# Altium schematic sheet PA_Channel.SchDoc: RF Channel
size 420 x 297 mm; Author: G.K.; CompanyName: WUT; DrawnBy: G.K.; Organization: WUT ISE; Address1: Warsaw Univeristy of Technology; Address2: Nowowiejska 15/19; Revision: -; SheetNumber: -; SheetTotal: -; EDA_Number: ARTIQ; Projet: 8 Channel RF Power Amplifier; ModifiedBy: -; CreateDate: XX/XX/XXXX; CheckedDate: -; Title2: Power supply & protection; DivGrp: ISE; Designer: G.K.; ModifiedDate: -; ProjectName: 8 Channel RF Power Amplifier
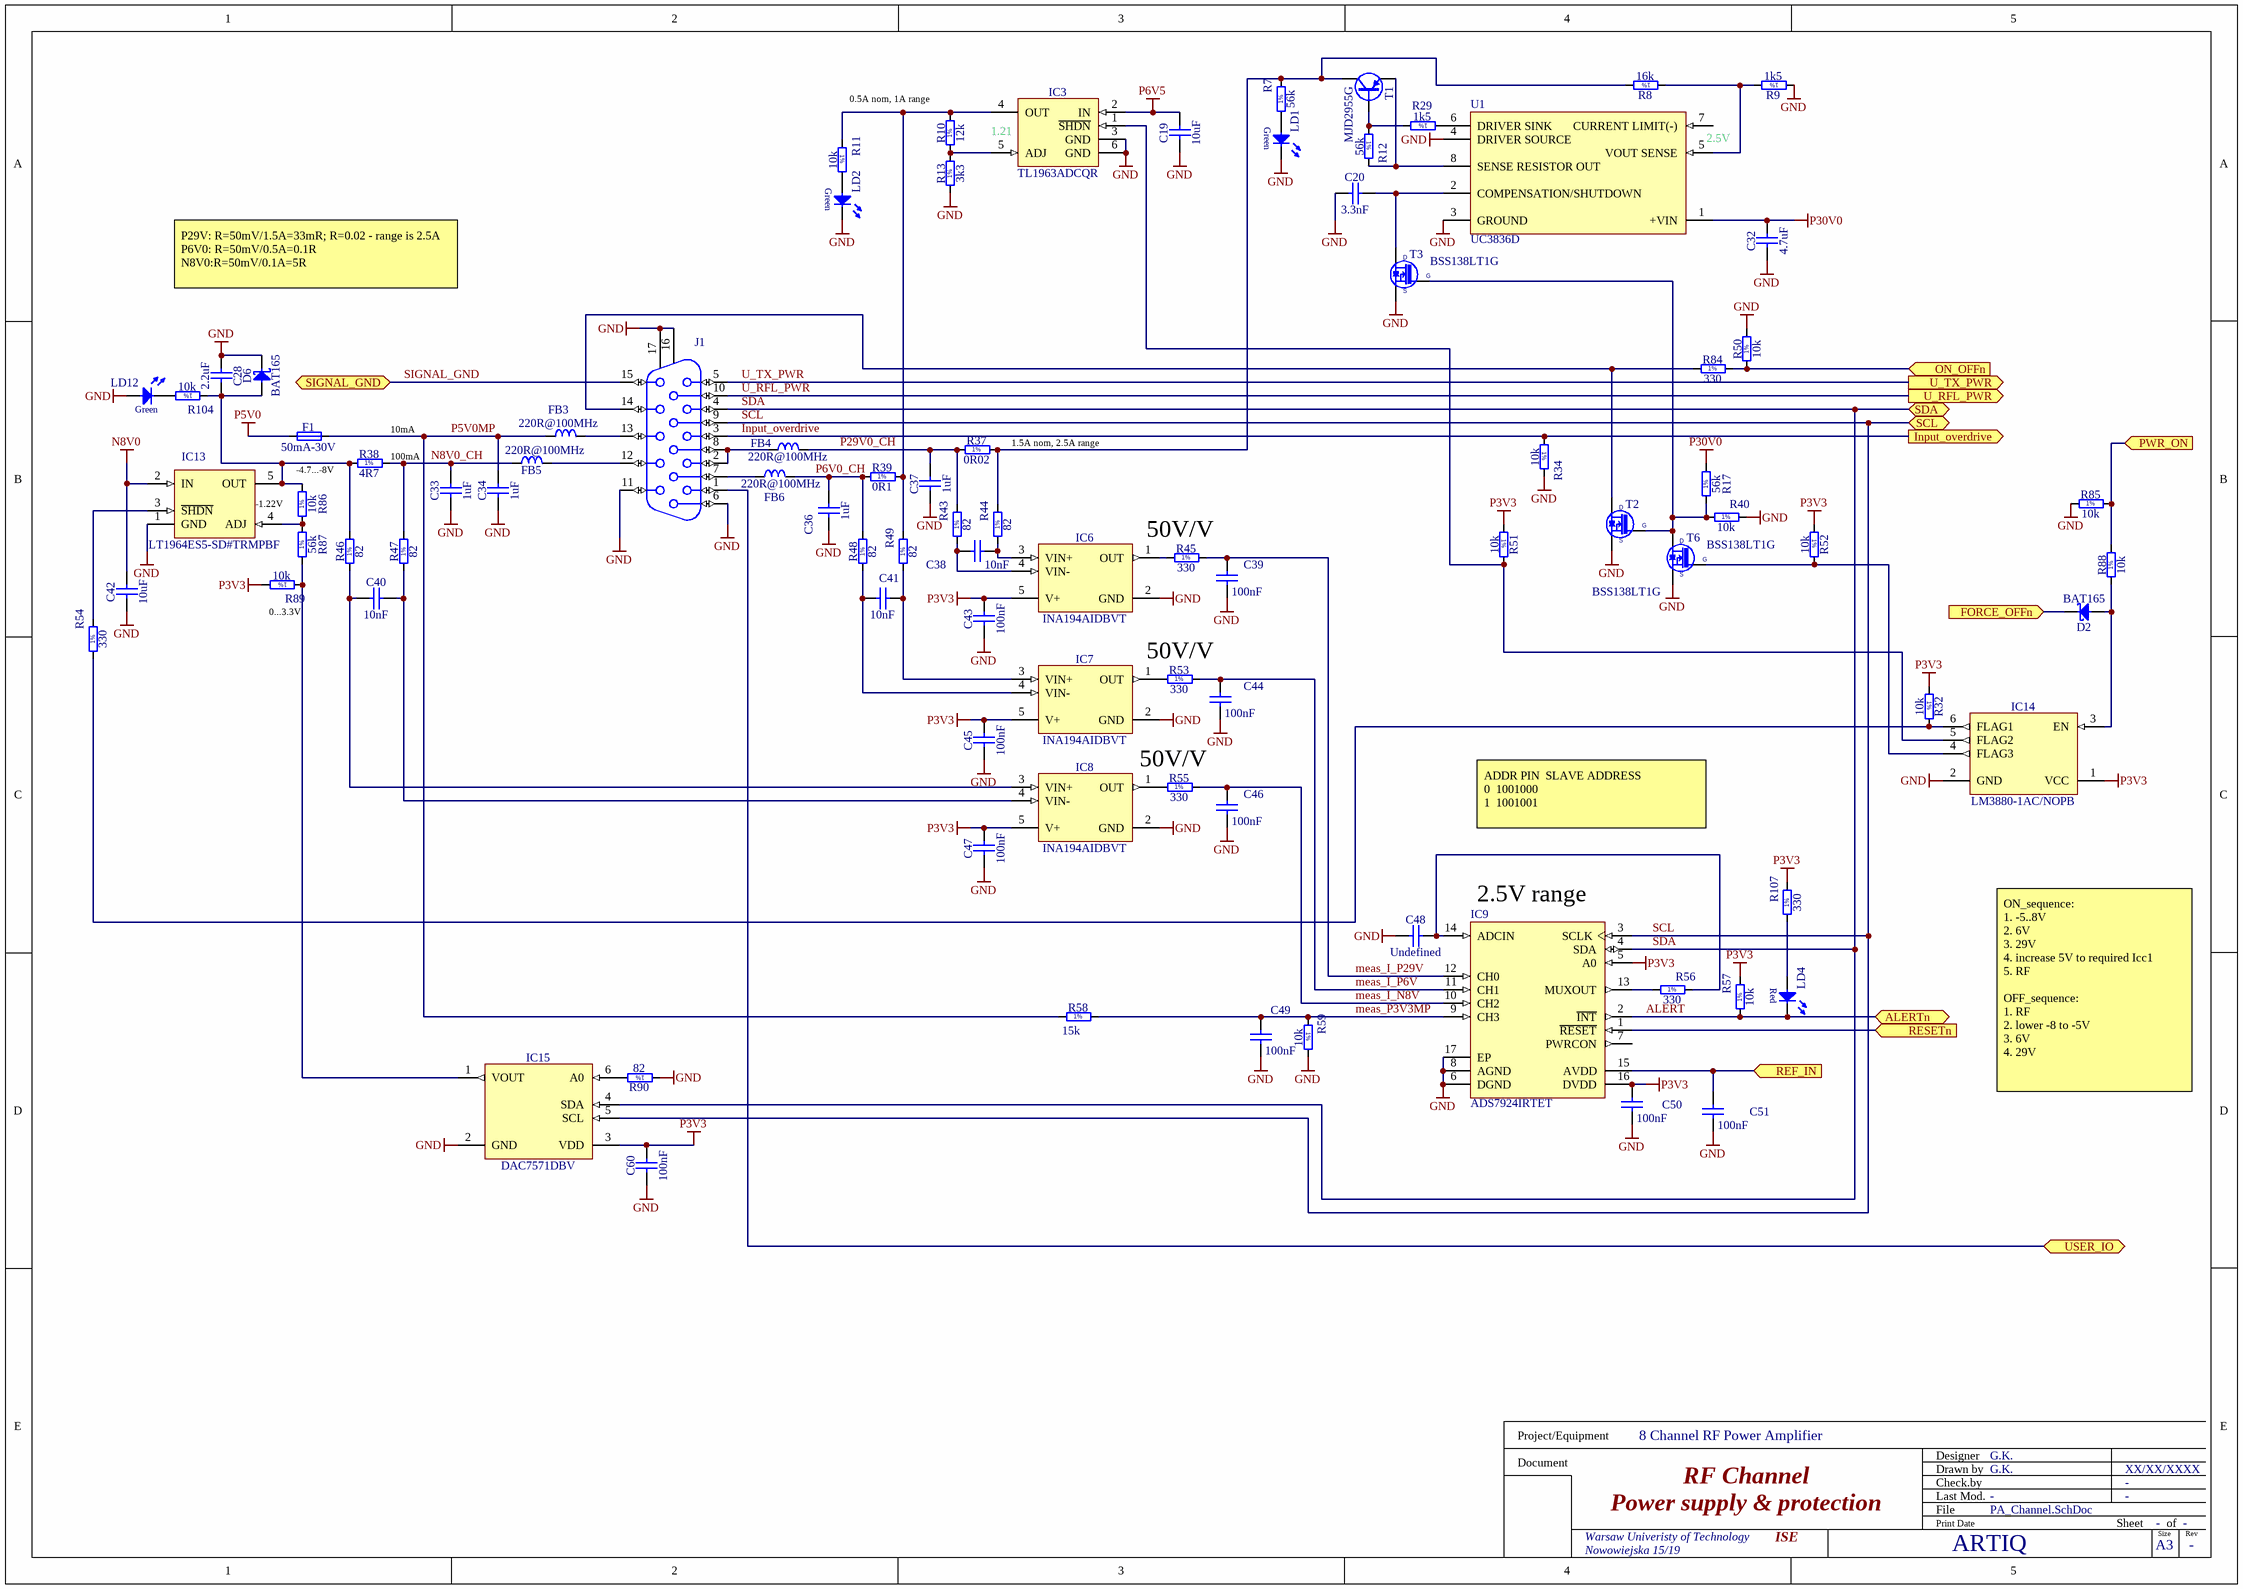
[diagram p0: PA_Channel.SchDoc]

## Parts
C19  10uF  [CAPC3216X140N]
C20  3.3nF  [CAPC1005X55N]
C28  2.2uF  [CAPC1608X87N]
C32  4.7uF  [CAPC3216X180N]
C33  1uF  [CAPC2012X110N]
C34  1uF  [CAPC2012X110N]
C36  1uF  [CAPC2012X110N]
C37  1uF  [CAPC2012X110N]
C38  10nF  [CAPC1608X87N]
C39  100nF  [CAPC1005X55N]
C40  10nF  [CAPC1608X87N]
C41  10nF  [CAPC1608X87N]
C42  10uF  [CAPC3216X140N]
C43  100nF  [CAPC1005X55N]
C44  100nF  [CAPC1005X55N]
C45  100nF  [CAPC1005X55N]
C46  100nF  [CAPC1005X55N]
C47  100nF  [CAPC1005X55N]
C48  Undefined  [CAPC1005X55N]
C49  100nF  [CAPC1005X55N]
C50  100nF  [CAPC1005X55N]
C51  100nF  [CAPC1005X55N]
C60  100nF  [CAPC1005X55N]
D2  BAT165  [SOD2512X110N]
D6  BAT165  [SOD2512X110N]
F1  50mA-30V  [FUSRC3226X85N]
FB3  220R@100MHz  [INDC2012X105N]
FB4  220R@100MHz  [INDC2012X105N]
FB5  220R@100MHz  [INDC2012X105N]
FB6  220R@100MHz  [INDC2012X105N]
IC3  TL1963ADCQR  [SOT127P700X180-6N]
IC6  INA194AIDBVT  [SOT95P280X145-5N]
IC7  INA194AIDBVT  [SOT95P280X145-5N]
IC8  INA194AIDBVT  [SOT95P280X145-5N]
IC9  ADS7924IRTET  [TI-RTE16-1700X1700TP_V]
IC13  LT1964ES5-SD#TRMPBF  [SOT95P280X100-5N]
IC14  LM3880-1AC/NOPB  [SOT95P280X145-6N]
IC15  DAC7571DBV  [SOT95P280X145-6N]
J1  HD-Sub  [TYCO_1932144-1]  (value not drawn)
LD1  Green  [LED_KINGBRIGHT_KPH-1608CGCK]  (value not drawn)
LD2  Green  [LED_KINGBRIGHT_KPH-1608CGCK]  (value not drawn)
LD4  Hyper Red  [LED_KINGBRIGHT_KPH-1608SURCK]  (value not drawn)
LD12  Green  [LED_KINGBRIGHT_KPH-1608CGCK]  (value not drawn)
R7  56k  [RESC1608X55N]
R8  16k  [RESC1608X55N]
R9  1k5  [RESC1608X55N]
R10  12k  [RESC1005X40N]
R11  10k  [RESC1005X40N]
R12  56k  [RESC1608X55N]
R13  3k3  [RESC1005X40N]
R17  56k  [RESC1608X55N]
R29  1k5  [RESC1608X55N]
R32  10k  [RESC1005X40N]
R34  10k  [RESC1005X40N]
R37  0R02  [RESC3216X80N]
R38  4R7  [RESC3216X65N]
R39  0R1  [RESC3216X65N]
R40  10k  [RESC1005X40N]
R43  82  [RESC1005X40N]
R44  82  [RESC1005X40N]
R45  330  [RESC1608X55N]
R46  82  [RESC1005X40N]
R47  82  [RESC1005X40N]
R48  82  [RESC1005X40N]
R49  82  [RESC1005X40N]
R50  10k  [RESC1005X40N]
R51  10k  [RESC1005X40N]
R52  10k  [RESC1005X40N]
R53  330  [RESC1608X55N]
R54  330  [RESC1608X55N]
R55  330  [RESC1608X55N]
R56  330  [RESC1608X55N]
R57  10k  [RESC1005X40N]
R58  15k  [RESC1005X40N]
R59  10k  [RESC1005X40N]
R84  330  [RESC1608X55N]
R85  10k  [RESC1005X40N]
R86  10k  [RESC1005X40N]
R87  56k  [RESC1608X55N]
R88  10k  [RESC1005X40N]
R89  10k  [RESC1005X40N]
R90  82  [RESC1005X40N]
R104  10k  [RESC1005X40N]
R107  330  [RESC1608X55N]
T1  MJD2955G  [TO228P991X239-3N-R552X520]
T2  BSS138LT1G  [SOT95P240X110-3N]
T3  BSS138LT1G  [SOT95P240X110-3N]
T6  BSS138LT1G  [SOT95P240X110-3N]
U1  UC3836D  [D0008A_M]

## Ports
ALERTn (bidir), FORCE_OFFn (in), Input_overdrive (out), ON_OFFn (in), PWR_ON (in), REF_IN (in), RESETn (in), SCL (bidir), SDA (bidir), SIGNAL_GND (bidir), U_RFL_PWR (out), U_TX_PWR (out), USER_IO (bidir)

## Nets
GND: C19.1 C20.1 C28.1 C32.1 C33.1 C34.1 C36.1 C37.1 C39.2 C42.1 C43.1 C44.2 C45.1 C46.2 C47.1 C48.1 C49.2 C50.2 C51.2 C60.1 D6.1(C) IC3.3(GND) IC3.6(GND) IC6.2(GND) IC7.2(GND) IC8.2(GND) IC9.6(DGND) IC9.8(AGND) IC9.17(EP) IC13.1(GND) IC14.2(GND) IC15.2(GND) J1.6 J1.11 J1.16 J1.17 LD1.1(C) LD2.1(C) LD12.2(A) R9.1 R13.1 R34.2 R40.2 R50.2 R59.2 R85.1 R90.1 T2.2(S) T3.2(S) T6.2(S) U1.3(GROUND) U1.4(DRIVER_SOURCE)
N8V0: C42.2 IC13.2(IN)
P3V3: C43.2 C45.2 C47.2 C50.1 C60.2 IC6.5(V+) IC7.5(V+) IC8.5(V+) IC9.5(A0) IC9.16(DVDD) IC14.1(VCC) IC15.3(VDD) R32.1 R51.1 R52.1 R57.2 R89.2 R107.2
P5V0: F1.1
P6V5: C19.2 IC3.2(IN)
P30V0: C32.2 R17.2 U1.1(+VIN)
ALERT: IC9.2(~{INT}) LD4.1(C) R57.1 ; port ALERTn
FORCE_OFFn: D2.1(C) ; port FORCE_OFFn
Input_overdrive: J1.3 R34.1 ; port Input_overdrive
meas_I_N8V: C46.1 IC9.10(CH2) R55.2
meas_I_P6V: C44.1 IC9.11(CH1) R53.2
meas_I_P29V: C39.1 IC9.12(CH0) R45.2
meas_P3V3MP: C49.1 IC9.9(CH3) R58.2 R59.1
N8V0_CH: C33.2 FB5.1 R38.2 R47.2
ON_OFFn: R50.1 R84.2 ; port ON_OFFn
P5V0MP: C34.2 F1.2 FB3.1 R58.1
P6V0_CH: C36.2 FB6.2 R39.1 R48.2
P29V0_CH: C37.2 FB4.2 R37.1 R43.2
PWR_ON: R85.2 R88.2 ; port PWR_ON
REF_IN: C51.1 IC9.15(AVDD) ; port REF_IN
RESETn: IC9.1(~{RESET}) ; port RESETn
SCL: IC9.3(SCLK) IC15.5(SCL) J1.9 ; port SCL
SDA: IC9.4(SDA) IC15.4(SDA) J1.4 ; port SDA
SIGNAL_GND: J1.15 ; port SIGNAL_GND
U_RFL_PWR: J1.10 ; port U_RFL_PWR
U_TX_PWR: J1.5 ; port U_TX_PWR
USER_IO: J1.1 ; port USER_IO
NetC20_2: C20.2 T3.3(D) U1.2(COMPENSATION/SHUTDOWN)
NetC28_2: C28.2 D6.2(A) IC13.5(OUT) R38.1 R46.2 R86.2 R104.1
NetC38_1: C38.1 IC6.4(VIN-) R43.1
NetC38_2: C38.2 IC6.3(VIN+) R44.1
NetC40_1: C40.1 IC8.3(VIN+) R46.1
NetC40_2: C40.2 IC8.4(VIN-) R47.1
NetC41_1: C41.1 IC7.4(VIN-) R48.1
NetC41_2: C41.2 IC7.3(VIN+) R49.1
NetC48_2: C48.2 IC9.14(ADCIN) R56.2
NetD2_2: D2.2(A) IC14.3(EN) R88.1
NetFB3_2: FB3.2 J1.13
NetFB4_1: FB4.1 J1.2 J1.8
NetFB5_2: FB5.2 J1.12
NetFB6_1: FB6.1 J1.7
NetIC3_1: IC3.1(~{SHDN}) IC14.5(FLAG2) R51.2
NetIC3_4: IC3.4(OUT) R10.2 R11.1 R39.2 R49.2
NetIC3_5: IC3.5(ADJ) R10.1 R13.2
NetIC6_1: IC6.1(OUT) R45.1
NetIC7_1: IC7.1(OUT) R53.1
NetIC8_1: IC8.1(OUT) R55.1
NetIC9_13: IC9.13(MUXOUT) R56.1
NetIC13_3: IC13.3(~{SHDN}) R54.2
NetIC13_4: IC13.4(ADJ) R86.1 R87.2
NetIC14_4: IC14.4(FLAG3) R52.2 T6.1(G)
NetIC14_6: IC14.6(FLAG1) R32.2 R54.1
NetIC15_1: IC15.1(VOUT) R87.1 R89.1
NetIC15_6: IC15.6(A0) R90.2
NetJ1_14: J1.14 R84.1 T2.3(D)
NetLD1_2: LD1.2(A) R7.1
NetLD2_2: LD2.2(A) R11.2
NetLD4_2: LD4.2(A) R107.1
NetLD12_1: LD12.1(C) R104.2
NetR7_2: R7.2 R8.2 R37.2 R44.2 T1.3(C)
NetR8_1: R8.1 R9.2 U1.5(VOUT_SENSE)
NetR12_1: R12.1 R29.2 T1.1(B)
NetR12_2: R12.2 T1.2(E) U1.8(SENSE_RESISTOR_OUT)
NetR17_1: R17.1 R40.1 T2.1(G) T3.1(G) T6.3(D)
NetR29_1: R29.1 U1.6(DRIVER_SINK)

Not connected (* = marked no-connect by the designer): IC9 7(PWRCON); U1 7(CURRENT_LIMIT(-))

## Notes on the sheet
- (near R10) 0.5A nom, 1A range
- (near IC3) 1.21
- (near U1) 2.5V
- P29V: R=50mV/1.5A=33mR; R=0.02 - range is 2.5A
  P6V0: R=50mV/0.5A=0.1R
  N8V0:R=50mV/0.1A=5R
- (near R38) 100mA
- (near R38) 10mA
- (near R37) 1.5A nom, 2.5A range
- (near IC13) -1.22V
- -4.7...-8V
- 50V/V
- (near R89) 0...3.3V
- ADDR PIN 	SLAVE ADDRESS
  0		1001000
  1		1001001
- (near IC9) 2.5V range
- ON_sequence:
  1. -5..8V
  2. 6V
  3. 29V
  4. increase 5V to required Icc1
  5. RF
  OFF_sequence:
  1. RF
  2. lower -8 to -5V
  3. 6V
  4. 29V
- Project/Equipment
- Document
- Designer
- Drawn by
- Check.by
- File
- Last Mod.
- Print Date
- Sheet
- Size
- A3
- of
- Rev
- (in symbol LED_KINGBRIGHT_KPH-1608SURCK) Red
- (in symbol R0402_3K3_1%_0.0625W_100PPM) 1%
- (in symbol R0402_10K_1%_0.0625W_100PPM) 1%
- (in symbol R0402_12K_1%_0.0625W_100PPM) 1%
- (in symbol R0402_15K_1%_0.0625W_100PPM) 1%
- (in symbol R0402_82R_1%_0.0625W_100PPM) 1%
- (in symbol R0603_1K5_1%_0.1W_100PPM) 1%
- (in symbol R0603_16K_1%_0.1W_100PPM) 1%
- (in symbol R0603_56K_1%_0.1W_100PPM) 1%
- (in symbol R0603_330R_1%_0.1W_100PPM) 1%
- (in symbol R1206_0R1_1%_0.25W_100PPM_YAGEO_PT) 1%
- (in symbol R1206_0R02_1%_1W_150PPM) 1%
- (in symbol R1206_4R7_1%_0.25W_200PPM) 1%

## Library data of the parts
C19 C42 = CC1206_10UF_16V_10%_X7R: Non-polarised capacitor; Part Description: SMD Multilayer Chip Ceramic Capacitor; Manufacturer: GENERIC; Manufacturer1 Part Number: C1206C106K4RAC; Voltage: 16V; TC: X7R; Tolerance: ±10%; Part Number: CC1206_10UF_16V_10%_X7R; Component Kind: Standard; Component Type: Standard; Pin Count: 2; Value: 10uF; Status: Preferred; Manufacturer Part Number: CC1206_10uF_16V_10%_X7R; Case: 1206; Mounted: Yes; Socket: No; SMD: Yes; Sense: No; Manufacturer1 Example: KEMET; Manufacturer1 ComponentHeight: 1.8mm; HelpURL: \\cern.ch\dfs\Applications\Altium\Datasheets\CC1206_X7R_KEMET.pdf; Author: CERN DEM JLC; CreateDate: 28.04.2009; LatestRevisionDate: 28.04.2009
C20 = CC0402_3.3NF_50V_10%_X7R: Non-polarised capacitor; Part Description: SMD Multilayer Chip Ceramic Capacitor; Manufacturer: GENERIC; Manufacturer1 Part Number: 223858715629; Voltage: 50V; TC: X7R; Tolerance: ±10%; Part Number: CC0402_3.3NF_50V_10%_X7R; Component Kind: Standard; Component Type: Standard; Pin Count: 2; Value: 3.3nF; Status: Not Recommended; Manufacturer Part Number: CC0402_3.3NF_50V_10%_X7R; Case: 0402; Mounted: Yes; Socket: No; SMD: Yes; Sense: No; Manufacturer1 Example: PHYCOMP; Manufacturer1 ComponentHeight: 0.55mm; HelpURL: \\cern.ch\dfs\Applications\Altium\Datasheets\CC0402_X7R_PHYCOMP.pdf; Author: CERN DEM JLC; CreateDate: 03.12.2007; LatestRevisionDate: 03.12.2007
C28 = CC0603_2.2UF_16V_10%_X5R: Non-polarised capacitor; Part Description: SMD Multilayer Chip Ceramic Capacitor; Manufacturer: GENERIC; Manufacturer1 Part Number: CC0603KRX5R7BB225; Voltage: 16V; TC: X5R; Tolerance: ±10%; Part Number: CC0603_2.2UF_16V_10%_X5R; Component Kind: Standard; Component Type: Standard; Pin Count: 2; Value: 2.2uF; Status: Preferred; Manufacturer Part Number: CC0603_2.2UF_16V_10%_X5R; Case: 0603; Mounted: Yes; Socket: No; SMD: Yes; Sense: No; Manufacturer1 Example: YAGEO; Manufacturer1 ComponentHeight: 0.9mm; HelpURL: \\cern.ch\dfs\Applications\Altium\Datasheets\CC0805_X5R_PHYCOMP_HC.pdf; Author: CERN DEM JLC; CreateDate: 28.04.2011; LatestRevisionDate: 28.04.2011
C32 = CC1206_4.7UF_50V_+80%-20%_Y5V: Non-polarised capacitor; Part Description: SMD Multilayer Chip Ceramic Capacitor; Manufacturer: GENERIC; Manufacturer1 Part Number: GRM31CF51H475ZA01L; Voltage: 50V; TC: Y5V; Part Number: CC1206_4.7UF_50V_+80%-20%_Y5V; Component Kind: Standard; Component Type: Standard; Pin Count: 2; Value: 4.7uF; Status: Preferred; Tolerance: +80%-20%; Manufacturer Part Number: CC1206_4.7UF_50V_+80%-20%_Y5V; Case: 1206; Mounted: Yes; Socket: No; SMD: Yes; Sense: No; Manufacturer1 Example: MURATA; Manufacturer1 ComponentHeight: 1.8mm; HelpURL: \\cern.ch\dfs\Applications\Altium\Datasheets\CC1206_MURATA_GRM31CF51H475ZA01L.pdf; Author: CERN DEM JLC; CreateDate: 20.06.2012; LatestRevisionDate: 20.06.2012
C33 C34 C36 C37 = CC0805_1UF_50V_10%_X7R: Non-polarised capacitor; Part Description: SMD Multilayer Chip Ceramic Capacitor; Manufacturer: GENERIC; Manufacturer1 Part Number: C0805C105K5RACTU; Voltage: 50V; TC: X7R; Tolerance: ±10%; Part Number: CC0805_1UF_50V_10%_X7R; Component Kind: Standard; Component Type: Standard; Pin Count: 2; Value: 1uF; Status: Preferred; Manufacturer Part Number: CC0805_1UF_50V_10%_X7R; Case: 0805; Mounted: Yes; Socket: No; SMD: Yes; Sense: No; Manufacturer1 Example: KEMET; Manufacturer1 ComponentHeight: 1.1mm; HelpURL: \\cern.ch\dfs\Applications\Altium\Datasheets\CC0805_X7R_KEMET.pdf; Author: CERN DEM JLC; CreateDate: 04.12.2013; LatestRevisionDate: 04.12.2013
C38 C40 C41 = CC0603_10NF_50V_5%_C0G: Non-polarised capacitor; Part Description: SMD Multilayer Chip Ceramic Capacitor; Manufacturer: GENERIC; Manufacturer1 Part Number: C1608C0G1H103J080AA; Voltage: 50V; TC: C0G/NP0; Tolerance: ±5%; Part Number: CC0603_10NF_50V_5%_C0G; Component Kind: Standard; Component Type: Standard; Pin Count: 2; Value: 10nF; Status: Preferred; Manufacturer Part Number: CC0603_10NF_50V_5%_C0G; Case: 0603; Mounted: Yes; Socket: No; SMD: Yes; Sense: No; Manufacturer1 Example: TDK; Manufacturer1 ComponentHeight: 0.9mm; HelpURL: \\cern.ch\dfs\Applications\Altium\Datasheets\CC0603_C0G_TDK_C.pdf; Author: CERN DEM JLC; CreateDate: 10.12.2014; LatestRevisionDate: 10.12.2014
C39 C44 C46 C49-C51 = CC0402_100NF_16V_10%_X7R: Non-polarised capacitor; Part Description: SMD Multilayer Chip Ceramic Capacitor; Manufacturer: GENERIC; Manufacturer1 Part Number: GRM155R71C104KA88D; Voltage: 16V; TC: X7R; Tolerance: ±10%; Table: Capacitors SMD; Part Number: CC0402_100NF_16V_10%_X7R; Component Kind: Standard; Component Type: Standard; Pin Count: 2; Value: 100nF; Status: Not Recommended; Manufacturer Part Number: CC0402_100NF_16V_10%_X7R; Case: 0402; Mounted: Yes; Socket: No; SMD: Yes; Manufacturer1 Example: MURATA; Manufacturer1 ComponentHeight: 0.55mm; HelpURL: \\cern.ch\dfs\Applications\Altium\Datasheets\CC0402_X7R_MURATA_GRM.pdf; Author: CERN DEM JLC; CreateDate: 2013-12-05; LatestRevisionDate: 2007-12-03
C43 C45 C47 C60 = CC0402_100NF_16V_10%_X7R: Non-polarised capacitor; Part Description: SMD Multilayer Chip Ceramic Capacitor; Manufacturer: GENERIC; Manufacturer1 Part Number: GRM155R71C104KA88D; Voltage: 16V; TC: X7R; Tolerance: ±10%; Part Number: CC0402_100NF_16V_10%_X7R; Component Kind: Standard; Component Type: Standard; Pin Count: 2; Value: 100nF; Status: Not Recommended; Manufacturer Part Number: CC0402_100NF_16V_10%_X7R; Case: 0402; Mounted: Yes; Socket: No; SMD: Yes; Sense: No; Manufacturer1 Example: MURATA; Manufacturer1 ComponentHeight: 0.55mm; HelpURL: \\cern.ch\dfs\Applications\Altium\Datasheets\CC0402_X7R_MURATA_GRM.pdf; Author: CERN DEM JLC; CreateDate: 05.12.2013; LatestRevisionDate: 03.12.2007
C48 = CC0402_NO-VALUE: Non-polarised capacitor; Part Description: Reserved Footprint For 0402(1005) Chip Ceramic Capacitor; Mounted: No; Part Number: CC0402_NO-VALUE; Component Kind: Standard; Component Type: Standard; Pin Count: 2; Value: Undefined; Status: None; Manufacturer: Undefined; Manufacturer Part Number: CC0402_NO-VALUE; Case: 0402; Socket: No; SMD: Yes; Sense: No; Manufacturer1 ComponentHeight: 0.55mm; HelpURL: Undefined; Author: CERN DEM JLC; CreateDate: 14.01.2014; LatestRevisionDate: 14.01.2014
D2 D6 = BAT165: Schottky Diode; Part Description: Medium Power AF Schottky Diode; Manufacturer: INFINEON; Voltage: 40V; Power: 750mA; PressFit: No; Bonding: No; Part Number: BAT165; Component Kind: Standard; Component Type: Standard; Device: BAT165; PackageDescription: Small Outline Diode Flat Lead (SOD-323), 1.70mm W X 1.25mm L X 1.10mm H body,  IPC Medium Density; Manufacturer Part Number: BAT165; Pin Count: 2; Case: SOD323; Mounted: Yes; Socket: No; SMD: Yes; Sense: No; ComponentHeight: 1.1mm; HelpURL: \\cern.ch\dfs\Applications\Altium\Datasheets\BAT165.pdf; Author: CERN DEM JLC; CreateDate: 12.11.2014; LatestRevisionDate: 12.11.2014
F1 = FUSR1210_TYCO-MICROSMD005F: Fuse; Part Description: PolySwitch® PTC Overcurrent Protection Device; Manufacturer: TYCO ELECTRONICS; PressFit: No; Part Number: FUSR1210_TYCO-MICROSMD005F; Component Kind: Standard; Component Type: Standard; Pin Count: 2; PackageDescription: Chip Resettable Fuse, 2-Leads, Body 3.2mm x 2.6mm, IPC Medium Density; Family: Fuses Resettable; Mounted: Yes; Socket: No; SMD: Yes; Sense: No; Value: 50mA-30V; Manufacturer Part Number: microSMD005F; ComponentHeight: 0.85mm; HelpURL: \\cern.ch\dfs\Applications\Altium\Datasheets\FUSR_TYCO_microSMD005F.pdf; Author: CERN DEM JLC; CreateDate: 14.12.2010; LatestRevisionDate: 14.12.2010
FB3-FB6 = IND0805_MURATA_BLM21PG221SN1D: Inductor; Part Description: SMD EMIFIL Suppression Chip Ferrite Bead; Manufacturer: MURATA; Power: 2A; Resistance: 0.05R; Tolerance: ±25%; Table: Inductors SMD; Part Number: IND0805_MURATA_BLM21PG221SN1D; Component Kind: Standard; Component Type: Standard; Pin Count: 2; Value: 220R@100MHz; Status: None; Manufacturer Part Number: BLM21PG221SN1D; Case: 0805; Mounted: Yes; Socket: No; SMD: Yes; ComponentHeight: 1.05mm; HelpURL: \\cern.ch\dfs\Applications\Altium\Datasheets\IND0402_MURATA_BLM21P.pdf; Author: CERN DEM JLC; CreateDate: 2010-01-25; LatestRevisionDate: 2010-01-25
IC3 = TL1963ADCQR: 1.2V to 20V, 1.5A, Fast Transient Response, Low Noise, LDO Adjustable Regulator; Manufacturer: TEXAS INSTRUMENTS; PressFit: No; Bonding: No; Part Number: TL1963ADCQR; Component Kind: Standard; Component Type: Standard; Device: TL1963ADCQR; PackageDescription: SOT223, 6-Leads, Body 6.6x7.3mm (max), Pitch 1.27mm, IPC Medium Density; Part Description: 1.2V to 20V, 1.5A, Fast Transient Response, Low Noise, LDO Adjustable Regulator; Manufacturer Part Number: TL1963ADCQR; Pin Count: 6; Case: SOT223; Mounted: Yes; Socket: No; SMD: Yes; Sense: No; ComponentHeight: 1.8mm; HelpURL: \\cern.ch\dfs\Applications\Altium\Datasheets\TL1963ADCQR.pdf; Author: CERN DEM JLC; CreateDate: 08.07.2014; LatestRevisionDate: 08.07.2014
IC6-IC8 = INA194AIDBVT: Current Shunt Monitor -16V to +80V Common-Mode Range; Manufacturer: TEXAS INSTRUMENTS; PressFit: No; Bonding: No; Part Number: INA194AIDBVT; Component Kind: Standard; Component Type: Standard; Device: INA194AIDBVT; PackageDescription: SOT, 0.95mm pitch; 5 pin, 1.60mm W X 2.90mm L X 1.45mm H body, IPC Medium Density; Part Description: Current Shunt Monitor -16V to +80V Common-Mode Range; Manufacturer Part Number: INA194AIDBVT; Pin Count: 5; Case: SOT23-5; Mounted: Yes; Socket: No; SMD: Yes; Sense: No; ComponentHeight: 1.45mm; Author: CERN DEM JLC; HelpURL: \\cern.ch\dfs\Applications\Altium\Datasheets\INA194AIDBVT.pdf; CreateDate: 10.05.2010; LatestRevisionDate: 10.05.2010
IC9 = CMP-0003-02162-1: 12-Bit, 4-Channel Mux Input SAR ADC with Intelligent System Power Control, -40 to 85 degC, 16-pin QFN (RTE16), Green (RoHS & no Sb/Br); Manufacturer: Texas Instruments; Interface: Serial I2C; Resolution(Bits): 12; Sample Rate (max)(SPS): 100k; Digital Supply(Max)(V): 5.5; INL(Max)(+/-LSB): 1.5; # Input Channels: 4; Analog Voltage AV/DD(Min)(V): 2.2; SubFamily: Precision ADC (<=10MSPS); Digital Supply(Min)(V): 1.65; ComponentLink1Description: Manufacturer URL; DatasheetVersion: SBAS482A; ComponentLink3Description: Package Specification; ComponentLink2Description: Datasheet; PackageVersion: 4205254/D, 01/2011; Code_JEDEC: MO-220; Mounting Technology: Surface Mount; Eco-Plan: Green (RoHS & no Sb/Br); PackageReference: RTE16-1700X1700TP; PartNumber: ADS7924IRTET; Analog Voltage AV/DD(Max)(V): 5.5; ComponentLink3URL: http://www.ti.com/litv/pdf/mpqf149c; ComponentLink2URL: http://www.ti.com/general/docs/lit/getliterature.tsp?genericPartNumber=ADS7924&fileType=pdf; Architecture: SAR; ComponentLink1URL: http://www.ti.com/; PackageDescription: 16-Pin Plastic Flat Pack, Body 3 x 3 mm, Pitch 0.5 mm
IC13 = LT1964ES5-SD#TRMPBF: 200mA, Low Noise, Low Dropout Negative Micropower Regulator; Part Description: -1.22V to -20V, 200mA, Low Noise, Low Dropout Negative Micropower Regulator; Manufacturer: LINEAR TECHNOLOGY; PressFit: No; Bonding: No; Part Number: LT1964ES5-SD#TRMPBF; Component Kind: Standard; Component Type: Standard; Device: LT1964ES5-SD#TRMPBF; PackageDescription: SOT23, 0.95mm pitch; 5 pin, 1.75mm W X 3.00mm L, IPC Medium Density; Manufacturer Part Number: LT1964ES5-SD#TRMPBF; Pin Count: 5; Case: SOT23-5; Mounted: Yes; Socket: No; SMD: Yes; Sense: No; ComponentHeight: 1mm; HelpURL: \\cern.ch\dfs\Applications\Altium\Datasheets\LT1964ES5-SD#TRMPBF.pdf; Author: CERN DEM JLC; CreateDate: 05.05.2009; LatestRevisionDate: 05.05.2009
IC14 = LM3880-1AC/NOPB: Simple Power Sequencer; Part Description: Simple Power Sequencer, Power UP : 1 2 3, Power Down 3 2 1, Timing Designator 60ms; Manufacturer: TEXAS INSTRUMENTS; PressFit: No; Bonding: No; Part Number: LM3880-1AC/NOPB; Component Kind: Standard; Component Type: Standard; Device: LM3880-1AC/NOPB; PackageDescription: SOT23, 6-Leads, Body 1.6x3.0mm, Pitch 0.95mm, IPC Medium Density; Manufacturer Part Number: LM3880-1AC/NOPB; Pin Count: 6; Case: SOT23-6; Mounted: Yes; Socket: No; SMD: Yes; Sense: No; ComponentHeight: 1.45mm; Author: CERN DEM MR; HelpURL: \\cern.ch\dfs\Applications\Altium\Datasheets\LM3880-1AC-NOPB.pdf; CreateDate: 17.03.2016; LatestRevisionDate: 17.03.2016
IC15 = DAC7571DBV: +2.7 V to +5.5 V, I2C Interface (Receive Only), Voltage Output, 12-Bit Digital-To-Analog Converter; Manufacturer: TEXAS INSTRUMENTS; PressFit: No; Bonding: No; Part Number: DAC7571DBV; Component Kind: Standard; Component Type: Standard; Device: DAC7571DBV; PackageDescription: SOT23, 6-Leads, Body 1.6x3.0mm, Pitch 0.95mm, IPC Medium Density; Part Description: +2.7 V to +5.5 V, I2C Interface (Receive Only), Voltage Output, 12-Bit Digital-To-Analog Converter; Manufacturer Part Number: DAC7571DBV; Pin Count: 6; Case: SOT23-6; Mounted: Yes; Socket: No; SMD: Yes; Sense: No; ComponentHeight: 1.45mm; Author: CERN DEM MR; HelpURL: \\cern.ch\dfs\Applications\Altium\Datasheets\DAC7571DBV.pdf; CreateDate: 07.07.2016; LatestRevisionDate: 07.07.2016
J1 = CON_DB15_V_F_1932144-1: Connector High Density D-sub 15 Female; Part Description: 15 Female Contacts, Staight High Density D-SUB Connector With Boardlock and Threaded Insert (4-40 UNC), AMPLIMITE HD-22 Series; Manufacturer: TYCO ELECTRONICS; PressFit: No; Part Number: TYCO_1932144-1; Component Kind: Standard; Component Type: Standard; Pin Count: 17; Family: HD-Sub; Mounted: Yes; Socket: No; SMD: No; Sense: No; Status: None; Manufacturer Part Number: 1932144-1; ComponentHeight: 12.88mm; HelpURL: \\cern.ch\dfs\Applications\Altium\Datasheets\TYCO_5749768-1.pdf; Author: GK; CreateDate: 17.03.2015; LatestRevisionDate: 17.03.2015
LD1 LD2 LD12 = LED_KINGBRIGHT_KPH-1608CGCK: LED Green 1C 2A; Part Description: SMD Green LED, Case 1.6mmX0.8mm(0603), 0.65mm Thickness; PressFit: No; Bonding: No; Part Number: LED_KINGBRIGHT_KPH-1608CGCK; Component Kind: Standard; Component Type: Standard; Color: Green; PackageDescription: SMT Green LED, Case 0603, Body L 1.6 x W 0.8mm H 0.65mm; Manufacturer: KINGBRIGHT; Manufacturer Part Number: KPH-1608CGCK; Pin Count: 2; Mounted: Yes; Socket: No; SMD: Yes; Sense: No; ComponentHeight: 0.65mm; HelpURL: \\cern.ch\dfs\Applications\Altium\Datasheets\LED_KINGBRIGHT_KPH-1608CGCK.pdf; Author: CERN DEM JLC; CreateDate: 03.07.2017; LatestRevisionDate: 03.07.2017
LD4 = LED_KINGBRIGHT_KPH-1608SURCK: LED Red 1C 2A; Part Description: SMD Hyper Red LED, Case 1.6mmX0.8mm(0603), 0.65mm Thickness; PressFit: No; Bonding: No; Part Number: LED_KINGBRIGHT_KPH-1608SURCK; Component Kind: Standard; Component Type: Standard; Color: Hyper Red; PackageDescription: SMT Hyper Red LED, Case 0603, Body L 1.6 x W 0.8mm H 0.65mm; Manufacturer: KINGBRIGHT; Manufacturer Part Number: KPH-1608SURCK; Pin Count: 2; Mounted: Yes; Socket: No; SMD: Yes; Sense: No; ComponentHeight: 0.65mm; HelpURL: \\cern.ch\dfs\Applications\Altium\Datasheets\LED_KINGBRIGHT_KPH-1608SURCK.pdf; Author: CERN DEM JLC; CreateDate: 03.07.2017; LatestRevisionDate: 03.07.2017
R7 R12 R17 R87 = R0603_56K_1%_0.1W_100PPM: Resistor - 1%; Part Description: General Purpose Thick Film Chip Resistor; Manufacturer: GENERIC; Manufacturer1 Part Number: NRC06F5602TRF; Power: 0.1W; TC: ±100ppm/°C; Part Number: R0603_56K_1%_0.1W_100PPM; Component Kind: Standard; Component Type: Standard; Pin Count: 2; Value: 56k; Status: Preferred; Tolerance: ±1%; Manufacturer Part Number: R0603_56K_1%_0.1W_100PPM; Case: 0603; Mounted: Yes; Sense: No; Socket: No; SMD: Yes; Manufacturer1 Example: NIC COMPONENT; Manufacturer1 ComponentHeight: 0.55mm; HelpURL: \\cern.ch\dfs\Applications\Altium\Datasheets\R0603_NIC_NRC.pdf; Author: CERN DEM JLC; CreateDate: 03.12.2007; LatestRevisionDate: 13.03.2008
R8 = R0603_16K_1%_0.1W_100PPM: Resistor - 1%; Part Description: General Purpose Thick Film Chip Resistor; Manufacturer: GENERIC; Manufacturer1 Part Number: NRC06F1602TRF; Power: 0.1W; TC: ±100ppm/°C; Part Number: R0603_16K_1%_0.1W_100PPM; Component Kind: Standard; Component Type: Standard; Pin Count: 2; Value: 16k; Status: Preferred; Tolerance: ±1%; Manufacturer Part Number: R0603_16K_1%_0.1W_100PPM; Case: 0603; Mounted: Yes; Sense: No; Socket: No; SMD: Yes; Manufacturer1 Example: NIC COMPONENT; Manufacturer1 ComponentHeight: 0.55mm; HelpURL: \\cern.ch\dfs\Applications\Altium\Datasheets\R0603_NIC_NRC.pdf; Author: CERN DEM JLC; CreateDate: 03.12.2007; LatestRevisionDate: 13.03.2008
R9 R29 = R0603_1K5_1%_0.1W_100PPM: Resistor - 1%; Part Description: General Purpose Thick Film Chip Resistor; Manufacturer: GENERIC; Manufacturer1 Part Number: NRC06F1501TRF; Power: 0.1W; TC: ±100ppm/°C; Part Number: R0603_1K5_1%_0.1W_100PPM; Component Kind: Standard; Component Type: Standard; Pin Count: 2; Value: 1k5; Status: Preferred; Tolerance: ±1%; Manufacturer Part Number: R0603_1K5_1%_0.1W_100PPM; Case: 0603; Mounted: Yes; Sense: No; Socket: No; SMD: Yes; Manufacturer1 Example: NIC COMPONENT; Manufacturer1 ComponentHeight: 0.55mm; HelpURL: \\cern.ch\dfs\Applications\Altium\Datasheets\R0603_NIC_NRC.pdf; Author: CERN DEM JLC; CreateDate: 03.12.2007; LatestRevisionDate: 13.03.2008
R10 = R0402_12K_1%_0.0625W_100PPM: Resistor - 1%; Part Description: General Purpose Thick Film Chip Resistor; Manufacturer: GENERIC; Manufacturer1 Part Number: 232270671203L; TC: ±100ppm/°C; Part Number: R0402_12K_1%_0.0625W_100PPM; Component Kind: Standard; Component Type: Standard; Pin Count: 2; Value: 12k; Status: Not recommended; Power: 0.0625W; Tolerance: ±1%; Manufacturer Part Number: R0402_12K_1%_0.0625W_100PPM; Case: 0402; Mounted: Yes; Sense: No; Socket: No; SMD: Yes; Manufacturer1 Example: YAGEO PHYCOMP; Manufacturer1 ComponentHeight: 0.4mm; HelpURL: \\cern.ch\dfs\Applications\Altium\Datasheets\R0402_Phycomp_RC0402.pdf; Author: CERN DEM JLC; CreateDate: 03.12.2007; LatestRevisionDate: 17.10.2012
R11 R32 R34 R40 R50-R52 R57 R59 R85 R86 R88 R89 R104 = R0402_10K_1%_0.0625W_100PPM: Resistor - 1%; Part Description: General Purpose Thick Film Chip Resistor; Manufacturer: GENERIC; Manufacturer1 Part Number: 232270671003L; TC: ±100ppm/°C; Table: Resistors SMD; Part Number: R0402_10K_1%_0.0625W_100PPM; Component Kind: Standard; Component Type: Standard; Pin Count: 2; Value: 10k; Status: Not recommended; Power: 0.0625W; Tolerance: ±1%; Manufacturer Part Number: R0402_10K_1%_0.0625W_100PPM; Case: 0402; Mounted: Yes; Socket: No; SMD: Yes; Manufacturer1 Example: YAGEO PHYCOMP; Manufacturer1 ComponentHeight: 0.4mm; HelpURL: \\cern.ch\dfs\Applications\Altium\Datasheets\R0402_Phycomp_RC0402.pdf; Author: CERN DEM JLC; CreateDate: 2007-12-03; LatestRevisionDate: 2012-10-17
R13 = R0402_3K3_1%_0.0625W_100PPM: Resistor - 1%; Part Description: General Purpose Thick Film Chip Resistor; Manufacturer: GENERIC; Manufacturer1 Part Number: 232270673302L; TC: ±100ppm/°C; Part Number: R0402_3K3_1%_0.0625W_100PPM; Component Kind: Standard; Component Type: Standard; Pin Count: 2; Value: 3k3; Status: Not recommended; Power: 0.0625W; Tolerance: ±1%; Manufacturer Part Number: R0402_3K3_1%_0.0625W_100PPM; Case: 0402; Mounted: Yes; Sense: No; Socket: No; SMD: Yes; Manufacturer1 Example: YAGEO PHYCOMP; Manufacturer1 ComponentHeight: 0.4mm; HelpURL: \\cern.ch\dfs\Applications\Altium\Datasheets\R0402_Phycomp_RC0402.pdf; Author: CERN DEM JLC; CreateDate: 03.12.2007; LatestRevisionDate: 17.10.2012
R37 = R1206_0R02_1%_1W_150PPM: Resistor - 1%; Part Description: Low Value Thick Film Chip Resistor; Manufacturer: PANASONIC; Manufacturer Part Number: ERJ8BWFR020V; Power: 1W; TC: ±150ppm/°C; Part Number: R1206_0R02_1%_1W_150PPM; Component Kind: Standard; Component Type: Standard; Pin Count: 2; Value: 0R02; Status: Not recommended; Tolerance: ±1%; Case: 1206; Mounted: Yes; Sense: No; Socket: No; SMD: Yes; ComponentHeight: 0.8mm; HelpURL: \\cern.ch\dfs\Applications\Altium\Datasheets\R1206_PANASONIC_ERJ8BW.pdf; Author: CERN DEM JLC; CreateDate: 03.09.2012; LatestRevisionDate: 03.09.2012
R38 = R1206_4R7_1%_0.25W_200PPM: Resistor - 1%; Part Description: General Purpose Thick Film Chip Resistor; Manufacturer: GENERIC; Manufacturer1 Part Number: 232272464708L or RC1206FR-074R7L; Power: 0.25W; TC: ±200ppm/°C; Part Number: R1206_4R7_1%_0.25W_200PPM; Component Kind: Standard; Component Type: Standard; Pin Count: 2; Value: 4R7; Status: Preferred; Tolerance: ±1%; Manufacturer Part Number: R1206_4R7_1%_0.25W_200PPM; Case: 1206; Mounted: Yes; Sense: No; Socket: No; SMD: Yes; Manufacturer1 Example: YAGEO PHYCOMP; Manufacturer1 ComponentHeight: 0.65mm; HelpURL: \\cern.ch\dfs\Applications\Altium\Datasheets\R1206_Phycomp_RC1206.pdf; Author: CERN DEM JLC; CreateDate: 03.12.2007; LatestRevisionDate: 17.10.2012
R39 = R1206_0R1_1%_0.25W_100PPM_YAGEO_PT: Resistor - 1%; Part Description: Current Sensor, Low TCR Chip Resistor; Manufacturer: YAGEO PHYCOMP; Manufacturer Part Number: PT1206FR-070R1L; Power: 0.25W; TC: ±100ppm/°C; Part Number: R1206_0R1_1%_0.25W_100PPM_YAGEO_PT; Component Kind: Standard; Component Type: Standard; Pin Count: 2; Value: 0R1; Status: None; Tolerance: ±1%; Case: 1206; Mounted: Yes; Sense: No; Socket: No; SMD: Yes; ComponentHeight: 0.65mm; HelpURL: \\cern.ch\dfs\Applications\Altium\Datasheets\R1206_YAGEO_PT.pdf; Author: CERN DEM JMW; CreateDate: 06.07.2015; LatestRevisionDate: 06.07.2015
R43 R44 R46-R49 R90 = R0402_82R_1%_0.0625W_100PPM: Resistor - 1%; Part Description: General Purpose Thick Film Chip Resistor; Manufacturer: GENERIC; Manufacturer1 Part Number: 232270678209L; TC: ±100ppm/°C; Part Number: R0402_82R_1%_0.0625W_100PPM; Component Kind: Standard; Component Type: Standard; Pin Count: 2; Value: 82; Status: Not recommended; Power: 0.0625W; Tolerance: ±1%; Manufacturer Part Number: R0402_82R_1%_0.0625W_100PPM; Case: 0402; Mounted: Yes; Sense: No; Socket: No; SMD: Yes; Manufacturer1 Example: YAGEO PHYCOMP; Manufacturer1 ComponentHeight: 0.4mm; HelpURL: \\cern.ch\dfs\Applications\Altium\Datasheets\R0402_Phycomp_RC0402.pdf; Author: CERN DEM JLC; CreateDate: 03.12.2007; LatestRevisionDate: 17.10.2012
R45 R53-R56 R84 R107 = R0603_330R_1%_0.1W_100PPM: Resistor - 1%; Part Description: General Purpose Thick Film Chip Resistor; Manufacturer: GENERIC; Manufacturer1 Part Number: NRC06F3300TRF; Power: 0.1W; TC: ±100ppm/°C; Table: Resistors SMD; Part Number: R0603_330R_1%_0.1W_100PPM; Component Kind: Standard; Component Type: Standard; Pin Count: 2; Value: 330; Status: Preferred; Tolerance: ±1%; Manufacturer Part Number: R0603_330R_1%_0.1W_100PPM; Case: 0603; Mounted: Yes; Socket: No; SMD: Yes; Manufacturer1 Example: NIC COMPONENT; Manufacturer1 ComponentHeight: 0.55mm; HelpURL: \\cern.ch\dfs\Applications\Altium\Datasheets\R0603_NIC_NRC.pdf; Author: CERN DEM JLC; CreateDate: 2007-12-03; LatestRevisionDate: 2008-03-13
R58 = R0402_15K_1%_0.0625W_100PPM: Resistor - 1%; Part Description: General Purpose Thick Film Chip Resistor; Manufacturer: GENERIC; Manufacturer1 Part Number: CRCW040215K0FKED; TC: ±100ppm/°C; PressFit: No; Part Number: R0402_15K_1%_0.0625W_100PPM; Component Kind: Standard; Component Type: Standard; Pin Count: 2; Value: 15k; Status: None; Power: 0.0625W; Tolerance: ±1%; Manufacturer Part Number: R0402_15K_1%_0.0625W_100PPM; Case: 0402; Mounted: Yes; Sense: No; Socket: No; SMD: Yes; Manufacturer1 Example: VISHAY; Manufacturer1 ComponentHeight: 0.4mm; HelpURL: \\cern.ch\dfs\Applications\Altium\Datasheets\R0402_VISHAY_CRCW e3.pdf; Author: CERN DEM JMW; CreateDate: 06.07.2015; LatestRevisionDate: 06.07.2015
T1 = MJD2955G: PNP Transistor; Part Description: 60V 10A 20W PNP Power Transistor; Manufacturer: ON SEMICONDUCTOR; PressFit: No; Bonding: No; Part Number: MJD2955G; Component Kind: Standard; Component Type: Standard; Device: MJD2955G; PackageDescription: TO-252AA DPAK TO, 2.28mm pitch; 2 pin,9.905mm L X 6.095mm W X 2.39mm H body, IPC Medium Density; Manufacturer Part Number: MJD2955G; Pin Count: 3; Case: DPAK; Mounted: Yes; Socket: No; SMD: Yes; Sense: No; ComponentHeight: 2.38mm; HelpURL: \\cern.ch\dfs\Applications\Altium\Datasheets\MJD2955G.pdf; Author: CERN DEM JLC; CreateDate: 28.11.2012; LatestRevisionDate: 28.11.2012
T2 T3 T6 = BSS138LT1G: N-CHANNEL MOSFET WITH DIODE; Part Description: 50V 200mA N-Channel Enhancement Mode Field-Effect Transistor; Manufacturer: ON SEMICONDUCTOR; PressFit: No; Bonding: No; Table: Transistors; Part Number: BSS138LT1G; Component Kind: Standard; Component Type: Standard; Device: BSS138LT1G; PackageDescription: SOT23 3-Leads, Pitch 0.95mm - Body 1.4x3mm, IPC Medium Density; Manufacturer Part Number: BSS138LT1G; Pin Count: 3; Case: SOT23-3; Mounted: Yes; Socket: No; SMD: Yes; ComponentHeight: 1.11mm; HelpURL: \\cern.ch\dfs\Applications\Altium\Datasheets\BSS138LT1G.pdf; Author: CERN DEM JLC; CreateDate: 2009-03-23; LatestRevisionDate: 2009-03-23
U1 = CMP-0322-00047-2: High Efficiency Regulator Controller, 2 % Tolerance, 6 to 40 V, 0 to 70 degC, 8-pin SOIC (D), Green (RoHS & no Sb/Br); Manufacturer: Texas Instruments; Vout Adj(Min)(V): 2.5; SubFamily: LDO Controller; Vin(Max)(V): 40; Vin(Min)(V): 6; Tolerance(%): 2; Iq(Typ)(mA): 3.7; Vout Adj(Max)(V): 35; ComponentLink1Description: Datasheet; PackageReference: D0008A; ComponentLink1URL: http://www.ti.com/general/docs/lit/getliterature.tsp?genericPartNumber=UC3836&fileType=pdf; DatasheetVersion: SLUS383; PackageDescription: 8-Pin Plastic Small Outline Integrated Circuit, 4.9 x 3.9 mm, Pitch 1.27 mm Pitch; PartNumber: UC3836D; Code_JEDEC: MS-012AA; Mounting Technology: Surface Mount; PackageVersion: revM, Jun-2011